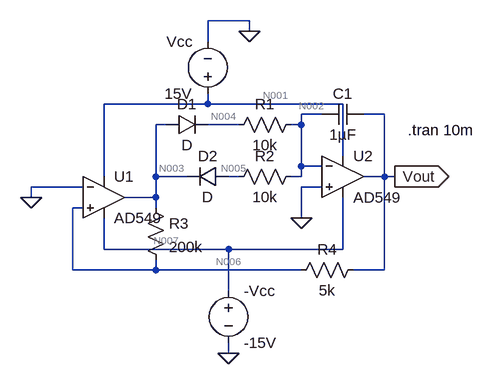
[diagram p0: schematic Q5.asc]
Q5.asc, the LTspice schematic file:
Version 4
SHEET 1 880 680
WIRE 368 -112 304 -112
WIRE 368 -96 368 -112
WIRE 304 -80 304 -112
WIRE 304 16 304 0
WIRE 304 16 144 16
WIRE 512 16 304 16
WIRE 480 32 448 32
WIRE 576 32 544 32
WIRE 240 48 224 48
WIRE 352 48 304 48
WIRE 448 48 448 32
WIRE 448 48 432 48
WIRE 512 96 512 16
WIRE 448 112 448 48
WIRE 480 112 448 112
WIRE 144 128 144 16
WIRE 224 128 224 48
WIRE 272 128 224 128
WIRE 352 128 336 128
WIRE 448 128 448 112
WIRE 448 128 432 128
WIRE 576 128 576 32
WIRE 576 128 544 128
WIRE 592 128 576 128
WIRE 112 144 32 144
WIRE 480 144 448 144
WIRE 32 160 32 144
WIRE 224 160 224 128
WIRE 224 160 176 160
WIRE 112 176 96 176
WIRE 224 176 224 160
WIRE 448 192 448 144
WIRE 144 240 144 192
WIRE 336 240 144 240
WIRE 512 240 512 160
WIRE 512 240 336 240
WIRE 96 272 96 176
WIRE 224 272 224 256
WIRE 224 272 96 272
WIRE 448 272 224 272
WIRE 576 272 576 128
WIRE 576 272 528 272
WIRE 336 304 336 240
WIRE 336 400 336 384
FLAG 448 192 0
FLAG 32 160 0
FLAG 368 -96 0
FLAG 336 400 0
FLAG 592 128 Vout
IOPIN 592 128 Out
SYMBOL voltage 304 16 R180
WINDOW 0 24 96 Left 2
WINDOW 3 24 16 Left 2
SYMATTR InstName Vcc
SYMATTR Value 15V
SYMBOL voltage 336 288 R0
SYMATTR InstName -Vcc
SYMATTR Value -15V
SYMBOL res 208 160 R0
SYMATTR InstName R3
SYMATTR Value 200k
SYMBOL res 448 32 R90
WINDOW 0 0 56 VBottom 2
WINDOW 3 32 56 VTop 2
SYMATTR InstName R1
SYMATTR Value 10k
SYMBOL res 448 112 R90
WINDOW 0 0 56 VBottom 2
WINDOW 3 32 56 VTop 2
SYMATTR InstName R2
SYMATTR Value 10k
SYMBOL diode 240 64 R270
WINDOW 0 32 32 VTop 2
WINDOW 3 0 32 VBottom 2
SYMATTR InstName D1
SYMBOL diode 336 112 R90
WINDOW 0 0 32 VBottom 2
WINDOW 3 32 32 VTop 2
SYMATTR InstName D2
SYMBOL cap 544 16 R90
WINDOW 0 0 32 VBottom 2
WINDOW 3 32 32 VTop 2
SYMATTR InstName C1
SYMATTR Value 1µF
SYMBOL res 544 256 R90
WINDOW 0 0 56 VBottom 2
WINDOW 3 32 56 VTop 2
SYMATTR InstName R4
SYMATTR Value 5k
SYMBOL Opamps\\AD549 144 96 R0
SYMATTR InstName U1
SYMBOL Opamps\\AD549 512 64 R0
SYMATTR InstName U2
TEXT 612 56 Left 2 !.tran 10m

The netlist it stands for:
* Q5.asc
Vcc N001 0 15V
V§-Vcc N007 0 -15V
R3 N003 N006 200k
R1 N002 N004 10k
R2 N002 N005 10k
D1 N003 N004 D
D2 N005 N003 D
C1 Vout N002 1µF
R4 Vout N006 5k
XU1 N006 0 N001 N007 N003 AD549  ; pins In+ In- V+ V- OUT
XU2 0 N002 N001 N007 Vout AD549  ; pins In+ In- V+ V- OUT
.model D D
.lib standard.dio
.tran 10m
.backanno
.end

* Results of the author's LTspice run, read from the files saved beside the schematic
* Operating Point, zero values left out:
*   V(n001) = 15 V
*   V(n007) = -15 V
*   V(n003) = -372 nV
*   V(n006) = 359 nV
*   V(n002) = -359 nV
*   V(n004) = -359 nV
*   V(n005) = -359 nV
*   V(vout) = 377.2 nV
*   I(R4) = 3.655 pA
*   I(R3) = -3.655 pA
*   I(-vcc) = 1.589 mA
*   I(Vcc) = -1.589 mA
*   Ix(u1:3) = 794.4 µA
*   Ix(u1:4) = -794.4 µA
*   Ix(u1:5) = 3.655 pA
*   Ix(u2:3) = 794.4 µA
*   Ix(u2:4) = -794.4 µA
*   Ix(u2:5) = -3.655 pA
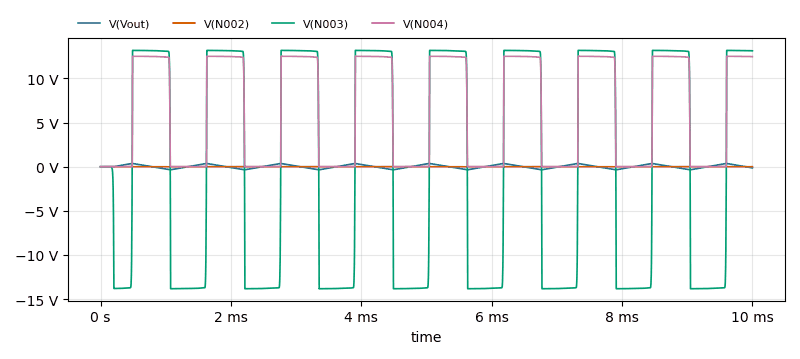
[diagram p1: Transient Analysis of Q5.asc, plotted from the saved traces]
* Transient Analysis, 1 run:
*   V(Vout): min -358.3 mV, max 380.1 mV, average 18.3 mV, rms 229.1 mV, last -128.5 mV
*   V(N002): min -9.483 mV, max 15.6 mV, average 7.734 µV, rms 1.207 mV, last 189.7 µV
*   V(N003): min -13.83 V, max 13.18 V, average 149.7 mV, rms 13.18 V, last 13.13 V
*   V(N004): min -9.483 mV, max 12.52 V, average 6.231 V, rms 8.795 V, last 12.47 V